# Altium schematic sheet circuit_Diagram.schdoc
size 214 x 63 mm
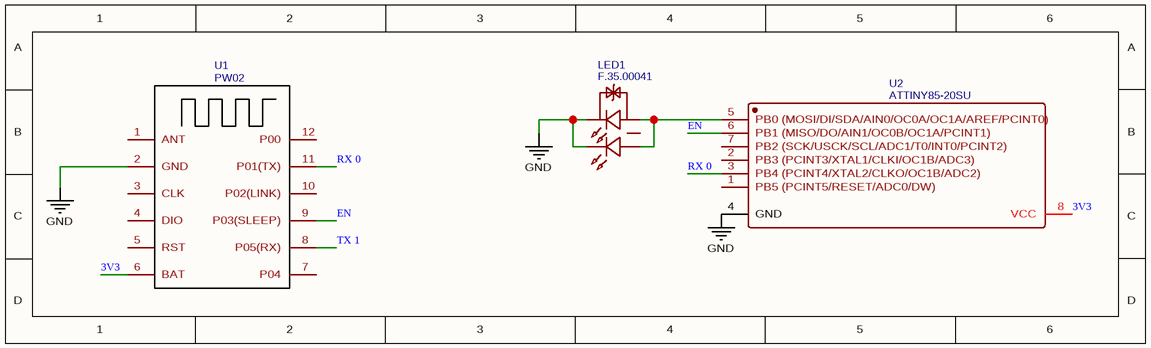
[diagram p0: circuit_Diagram.schdoc]

## Parts
LED1  F.35.00041  [LED-SMD_5P-L3.5-W3.5_UVC-UVA]
U1  PW02  [PW02]
U2  ATTINY85-20SU  [SOIC-8_L5.3-W5.3-P1.27-LS8.0-BL]

## Nets
GND: LED1.2(UVA-) LED1.4(UVC-) U1.2(GND) U2.4(GND)
3V3: U1.6(BAT) U2.8(VCC)
EN: U1.9(P03(SLEEP)) U2.6(PB1_(MISO/DO/AIN1/OC0B/OC1A/PCINT1))
RX 0: U1.11(P01(TX)) U2.3(PB4_(PCINT4/XTAL2/CLKO/OC1B/ADC2))
TX 1: U1.8(P05(RX))
NetLED1_1: LED1.1(UVA+) LED1.3(UVC+) U2.5(PB0_(MOSI/DI/SDA/AIN0/OC0A/OC1A/AREF/PCINT0))

Not connected (* = marked no-connect by the designer): LED1 5(EP); U1 1(ANT) 3(CLK) 4(DIO) 5(RST) 7(P04) 10(P02(LINK)) 12(P00); U2 1(PB5_(PCINT5/RESET/ADC0/DW)) 2(PB3_(PCINT3/XTAL1/CLKI/OC1B/ADC3)) 7(PB2_(SCK/USCK/SCL/ADC1/T0/INT0/PCINT2))

## Library data of the parts
LED1 = F.35.00041: BOM_Manufacturer: TUOZHAN; Contributor: LCSC; BOM_Supplier: LCSC; BOM_Supplier Part: C909692; BOM_Manufacturer Part: F.35.00041; BOM_JLCPCB Part Class: Extended Part; spicePre: L; spiceSymbolName: F.35.00041
U1 = PW02: BOM_Manufacturer: 鹏为物联; Contributor: jzy1115; BOM_Supplier: 鹏为物联; link: http://www.phangwei.com/p/PW02-Datasheet.pdf; spicePre: U; spiceSymbolName: PW02
U2 = ATTINY85-20SU: BOM_Manufacturer: MICROCHIP; BOM_Supplier: LCSC; BOM_Manufacturer Part: ATTINY85-20SU; BOM_Supplier Part: C89852; BOM_JLCPCB Part Class: Extended Part; spicePre: U; spiceSymbolName: ATTINY85-20SU